# EAGLE schematic Compuertas logicas (EAGLE 7.6.0)
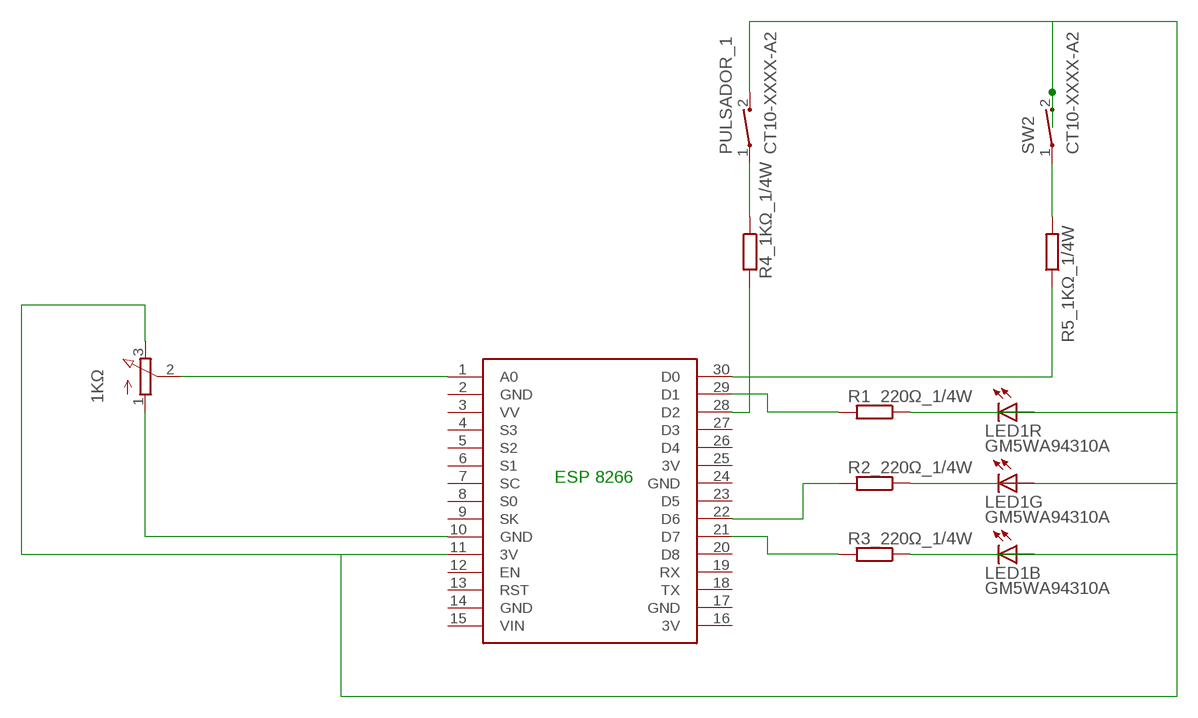
[diagram p0: schematic, sheet 1]

## Parts
1KΩ  3RP/1610N  [3RP/1610N]
LED1  GM5WA94310A  [GM5WA94310A]
PULSADOR_1  CT10-XXXX-A2  [CT10-XXXX-A2]
R1_220Ω_1/4W  SMR  [SMR]
R2_220Ω_1/4W  SMR-0  [SMR-0]
R3_220Ω_1/4W  PMD  [PMD]
R4_1KΩ_1/4W  SMR-0  [SMR-0]
R5_1KΩ_1/4W  SMR  [SMR]
SW2  CT10-XXXX-A2  [CT10-XXXX-A2]
U$1  NODEMCU  [NODEMCU]

## Nets
N$1: 1KΩ.2(S) U$1.1(A0)
N$4: R1_220Ω_1/4W.2 U$1.29(D1)
N$6: R3_220Ω_1/4W.2 U$1.21(D7)
N$7: R2_220Ω_1/4W.2 U$1.22(D6)
N$8: 1KΩ.1(A) U$1.10(GND)
N$9: R5_1KΩ_1/4W.1 U$1.30(D0)
N$10: R4_1KΩ_1/4W.2 U$1.28(D2)
N$11: PULSADOR_1.1 R4_1KΩ_1/4W.1
N$12: R5_1KΩ_1/4W.2 SW2.1
RED: 1KΩ.3(E) LED1.1(B:A) LED1.2(R:A) LED1.5(R:C) LED1.6(B:C) PULSADOR_1.2 R1_220Ω_1/4W.1 R2_220Ω_1/4W.1 R3_220Ω_1/4W.1 SW2.2 U$1.11(3V)
Unconnected: LED1.3(G:A) LED1.4(G:C) U$1.3(VV) U$1.4(S3) U$1.5(S2) U$1.6(S1) U$1.7(SC) U$1.8(S0) U$1.9(SK) U$1.12(EN) U$1.13(RST) U$1.15(VIN) U$1.18(TX) U$1.19(RX) U$1.20(D8) U$1.23(D5) U$1.26(D4) U$1.27(D3)

## Notes on the sheet
- ESP 8266

## Power pins joined to a net without a drawn wire
3V: U$1.16(3V) U$1.25(3V)
GND: U$1.2(GND) U$1.14(GND) U$1.17(GND) U$1.24(GND)

## Library data of the parts
1KΩ = pot:3RP/1610N: 16mm Potentiometer one level Source: http://www.alphapotentiometers.net/html/16mm_pot_2.html
LED1 = led:GM5WA94310A: Chip LED RGB Source: http://document.sharpsma.com/files/GM5WA94310A_SS.pdf
PULSADOR_1 SW2 = switch-coto:CT10-XXXX-: CT10 Series Molded Switch Source: www.cotorelay.com .. Coto_Technology__CT10-1530-G1.pdf
R1_220Ω_1/4W R5_1KΩ_1/4W = resistor-shunt:SMR: SMD SHUNT RESISTOR; OC_FARNELL: unknown; OC_NEWARK: unknown
R2_220Ω_1/4W R4_1KΩ_1/4W = resistor-shunt:SMR-0: SMD SHUNT RESISTOR; OC_FARNELL: unknown; OC_NEWARK: unknown
R3_220Ω_1/4W = resistor-shunt:PMD: SMD SHUNT RESISTOR; OC_FARNELL: unknown; OC_NEWARK: unknown
U$1 = nodemcu:NODEMCU